# EAGLE schematic esp_all3 (EAGLE 7.6.0)
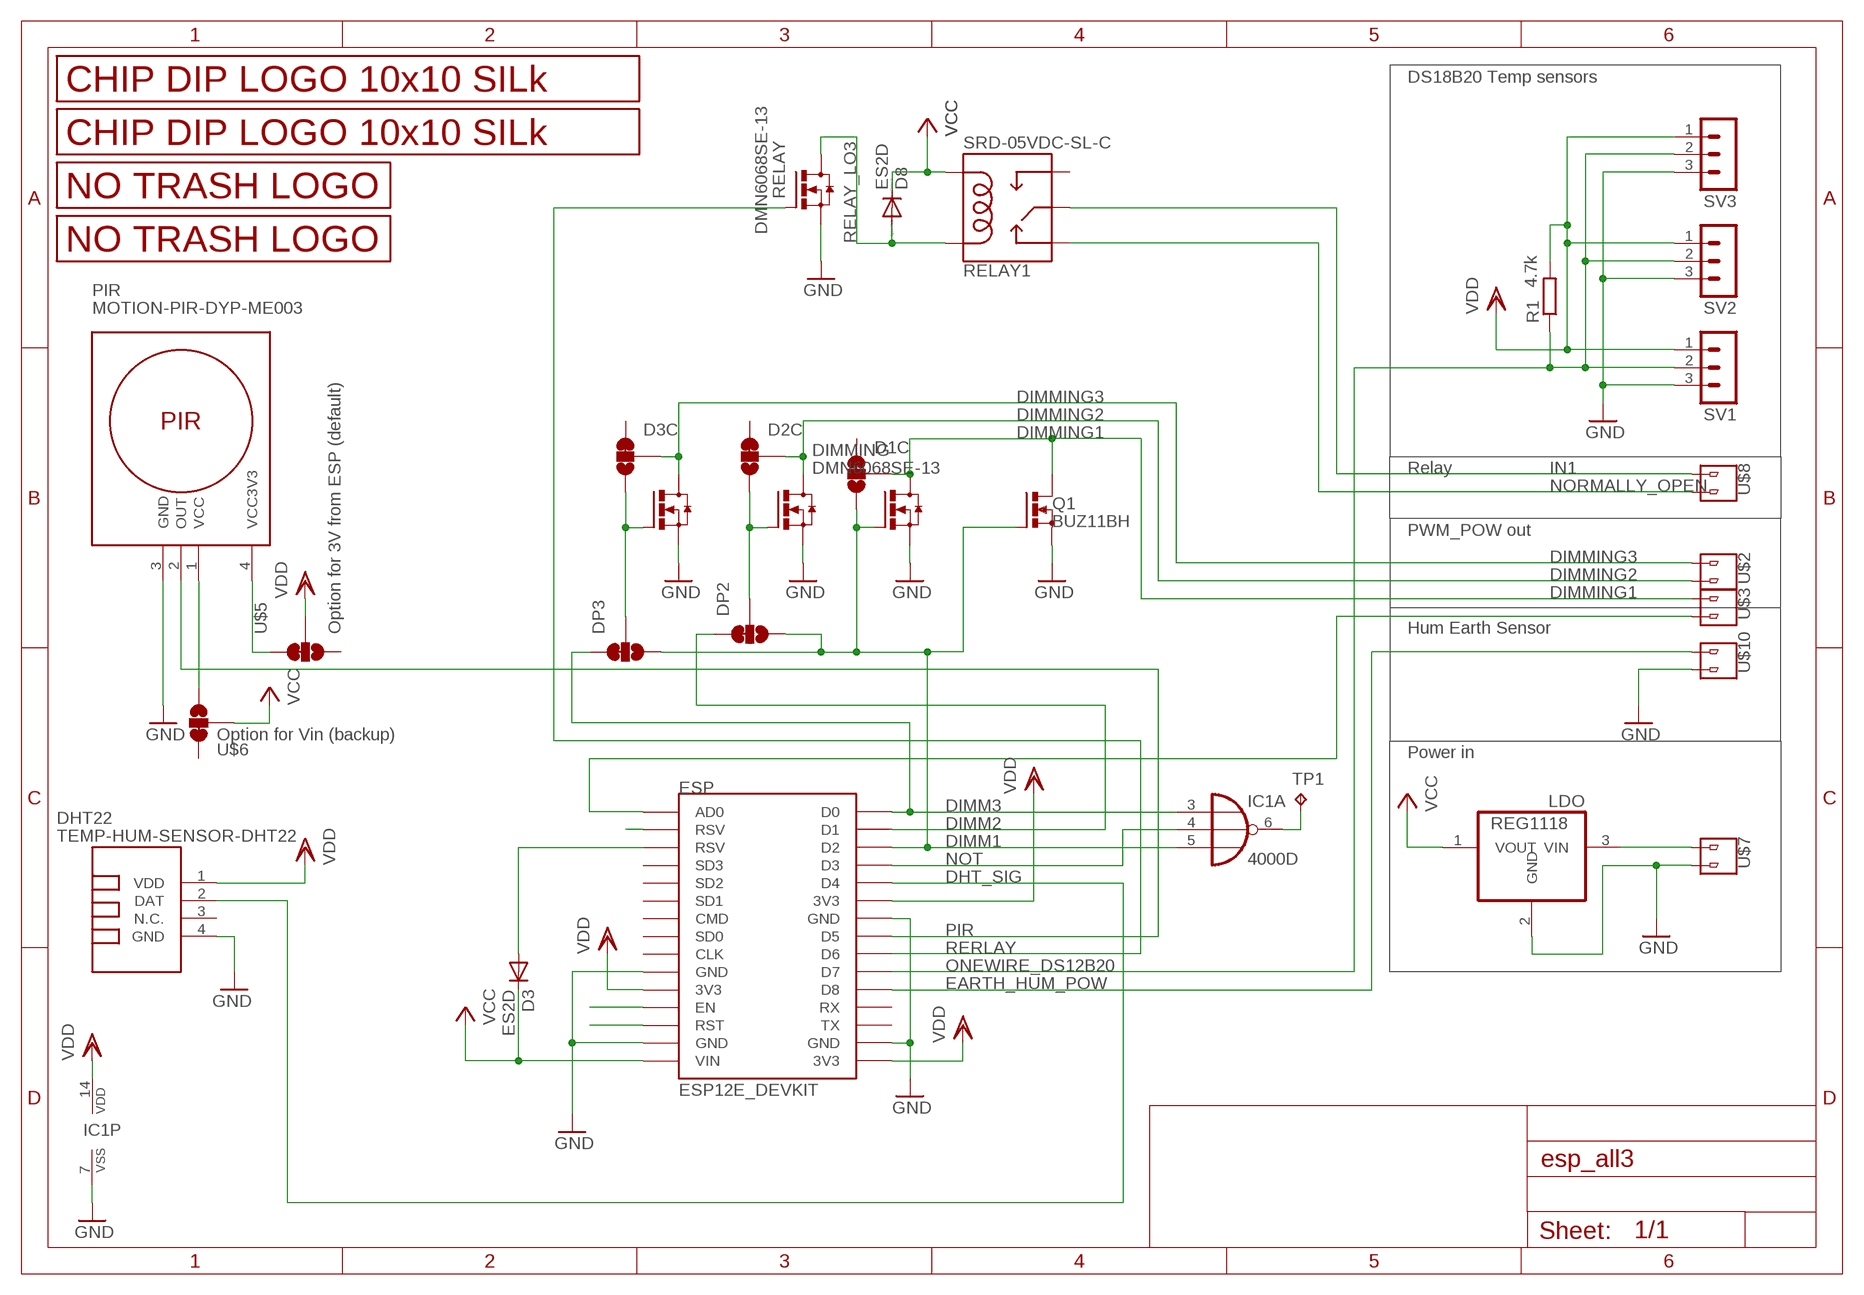
[diagram p0: schematic, sheet 1]

## Parts
D1C  SMD_SJ_3WAY_CLOSED  [SMD_SJ_3WAY_CLOSED]
D2C  SMD_SJ_3WAY_CLOSED  [SMD_SJ_3WAY_CLOSED]
D3  ES2D  [SMB]
D3C  SMD_SJ_3WAY_CLOSED  [SMD_SJ_3WAY_CLOSED]
D8  ES2D  DIODE-SMB  [SMB]
DHT22  TEMP-HUM-SENSOR-DHT22  [TEMP-HUM-SENSOR-DHT22]
DIMMING  DMN6068SE-13  NMOSFET_SMD_223  [SOT223]
DIMMING1  DMN6068SE-13  NMOSFET_SMD_223  [SOT223]
DIMMING2  DMN6068SE-13  NMOSFET_SMD_223  [SOT223]
DP2  SMD_SJ_3WAY_CLOSED  [SMD_SJ_3WAY_CLOSED]
DP3  SMD_SJ_3WAY_CLOSED  [SMD_SJ_3WAY_CLOSED]
ESP  ESP12E_DEVKIT  [ESP12E_DEVKIT]
IC1  4000D  [SO14]
LDO  REG1118  [SOT223]
PIR  MOTION-PIR-DYP-ME003  [MOTION-PIR-DYP-ME003]
Q1  BUZ11BH  [TO220BH]
R1  4.7k  R-EU_M0805  [M0805]
RELAY  DMN6068SE-13  NMOSFET_SMD_223  [SOT223]
RELAY1  SRD-05VDC-SL-C  RELAYPTH  [SRD-05VDC-SL-C]
SV1  MA03-1  [MA03-1]
SV2  MA03-1  [MA03-1]
SV3  MA03-1  [MA03-1]
TP1  TPTP20SQ  [TP20SQ]
U$1  LOGO_10X10_SILK  [LOGO2_10X10_SILK]
U$2  V1  2_PIN_CONNECTOR  [2_SCREW_PIN]
U$3  V1  2_PIN_CONNECTOR  [2_SCREW_PIN]
U$4  LOGO_NO_TRASHNO_TRASH  [LOGO_ROHS_NO_TRASH]
U$5  SMD_SJ_3WAY_CLOSED  [SMD_SJ_3WAY_CLOSED]
U$6  SMD_SJ_3WAY_CLOSED  [SMD_SJ_3WAY_CLOSED]
U$7  V1  2_PIN_CONNECTOR  [2_SCREW_PIN]
U$8  V1  2_PIN_CONNECTOR  [2_SCREW_PIN]
U$9  LOGO_NO_TRASHROHS  [LOGO_ROHS_SYM]
U$10  V1  2_PIN_CONNECTOR  [2_SCREW_PIN]
U$11  LOGO_10X10_SILK  [LOGO2_10X10_SILK]

## Nets
DHT_SIG: DHT22.2(DAT) ESP.D4 ESP.D41(D4)
DIMM1: D1C.3 DIMMING.1(G) DP2.3 DP3.3 ESP.D2 ESP.D21(D2) IC1.5(A:I2) Q1.G
DIMM2: DP2.1 ESP.D1 ESP.D11(D1)
DIMM3: DP3.1 ESP.D0 ESP.D01(D0) IC1.3(A:I0)
DIMMING1: D1C.2 DIMMING.2(D) DIMMING.4(D) Q1.D U$3.P$1
DIMMING2: D2C.2 DIMMING1.2(D) DIMMING1.4(D) U$2.P$2
DIMMING3: D3C.2 DIMMING2.2(D) DIMMING2.4(D) U$2.P$1
EARTH_HUM_POW: ESP.D8 ESP.D81(D8) U$10.P$1
GND: DHT22.4(GND) DIMMING1.3(S) DIMMING2.3(S) DIMMING.3(S) ESP.GND@0(GND) ESP.GND@1(GND) ESP.GND@2(GND) ESP.GND@3(GND) ESP.GND@4(GND) ESP.GND@5(GND) ESP.GND@6(GND) ESP.GND@7(GND) IC1.7(P:VSS) LDO.2(GND) PIR.3(GND) Q1.S RELAY.3(S) SV1.3 SV2.3 SV3.3 U$7.P$2 U$10.P$2
IN1: RELAY1.SWCOMMON U$8.P$1
N$1: ESP.AD0 ESP.AD1(AD0) U$3.P$2
N$2: ESP.RSV@0(RSV) ESP.RSV@01(RSV)
N$4: IC1.6(A:O) TP1.TP
N$12: ESP.EN ESP.EN1(EN)
N$13: ESP.RST ESP.RST1(RST)
N$14: D3.A ESP.RSV@1(RSV) ESP.RSV@11(RSV)
N$17: LDO.3(VIN) U$7.P$1
N$20: D3C.3 DIMMING2.1(G) DP3.2
N$21: D2C.3 DIMMING1.1(G) DP2.2
N$24: PIR.4(VCC3V3) U$5.1
N$31: PIR.1(VCC) U$6.3
NORMALLY_OPEN: RELAY1.SWCLOSED(SWCLOSE) U$8.P$2
NOT: ESP.D3 ESP.D31(D3) IC1.4(A:I1)
ONEWIRE_DS12B20: ESP.D7 ESP.D71(D7) R1.1 SV1.2 SV2.2 SV3.2
PIR: ESP.D5 ESP.D51(D5) PIR.2(OUT)
RELAY_LO3: D8.A RELAY1.COIL1 RELAY.2(D) RELAY.4(D)
RERLAY: ESP.D6 ESP.D61(D6) RELAY.1(G)
VCC: D3.C D8.C ESP.VIN ESP.VIN1(VIN) LDO.1(VOUT) RELAY1.COIL0 U$6.2
VDD: DHT22.1(VDD) ESP.3V3@0(3V3) ESP.3V3@1(3V3) ESP.3V3@2(3V3) ESP.3V3@3(3V3) ESP.3V3@4(3V3) ESP.3V3@5(3V3) IC1.14(P:VDD) R1.2 SV1.1 SV2.1 SV3.1 U$5.2
Unconnected: D1C.1 D2C.1 D3C.1 DHT22.3(N.C.) ESP.CLK ESP.CLK1(CLK) ESP.CMD ESP.CMD1(CMD) ESP.RX ESP.RX1(RX) ESP.SD0 ESP.SD1 ESP.SD01(SD0) ESP.SD2 ESP.SD3 ESP.SD12(SD1) ESP.SD22(SD2) ESP.SD32(SD3) ESP.TX ESP.TX1(TX) IC1.8(C:I) IC1.9(C:O) IC1.10(B:O) IC1.11(B:I2) IC1.12(B:I1) IC1.13(B:I0) RELAY1.SWOPEN U$5.3 U$6.1

## Notes on the sheet
- DS18B20 Temp sensors
- Relay
- PWM_POW out
- Option for 3V from ESP (default) | Hum Earth Sensor
- Option for Vin (backup)
- Power in

## Library data of the parts
D1C D2C D3C DP2 DP3 U$5 U$6 = JKW_CHIP:SMD_SJ_3WAY_CLOSED
D3 = diode:ES2D: DIODE super fast rectifier, 2 A
D8 = diode:DIODE-: DIODE
DHT22 = diy-modules:TEMP-HUM-SENSOR-DHT22: DHT22 - digital humidity & temperature sensor Also known as: AM2302 AM2302 datasheet available here: http://akizukidenshi.com/download/ds/aosong/AM2302.pdf Click here to find device on ebay.com <http://www.ebay.com/sch/dht22+digital+sensor>
DIMMING DIMMING1 DIMMING2 RELAY = transistor-power:NMOSFET_SMD_223
ESP = ESP12E_DEVKIT:ESP12E_DEVKIT: ESP12E DEVKIT BOARD
IC1 = 40xx:4000: Dual 3-input NOR & INVERTER
LDO = burr-brown:REG1118: 800mA Low Dropout (LDO) Positive Regulator with Current Source and Sink Capability; MPN: REG1118-2.85/2K5G4; OC_FARNELL: unknown; OC_NEWARK: 14M2185
PIR = diy-modules:MOTION-PIR-DYP-ME003: PIR Motion Sensor Module DYP-ME003 based on BISS0001 pyroelectic detector Click here to find device on ebay.com <http://www.ebay.com/sch/dyp+me003>
Q1 = transistor-power:BUZ11: N-CHANNEL MOS FET
R1 = rcl:R-EU_: RESISTOR, European symbol
RELAY1 = JKW_CHIP:RELAY: SPDT relay (COM-00101)
SV1-SV3 = con-lstb:MA03-1: PIN HEADER; OC_FARNELL: unknown; OC_NEWARK: unknown
TP1 = testpad:TP: Test pad
U$1 U$11 = JKW_CHIP:LOGO_10X10_SILK
U$2 U$3 U$7 U$8 U$10 = JKW_CHIP:2_PIN_CONNECTOR
U$4 U$9 = JKW_CHIP:LOGO_NO_TRASH